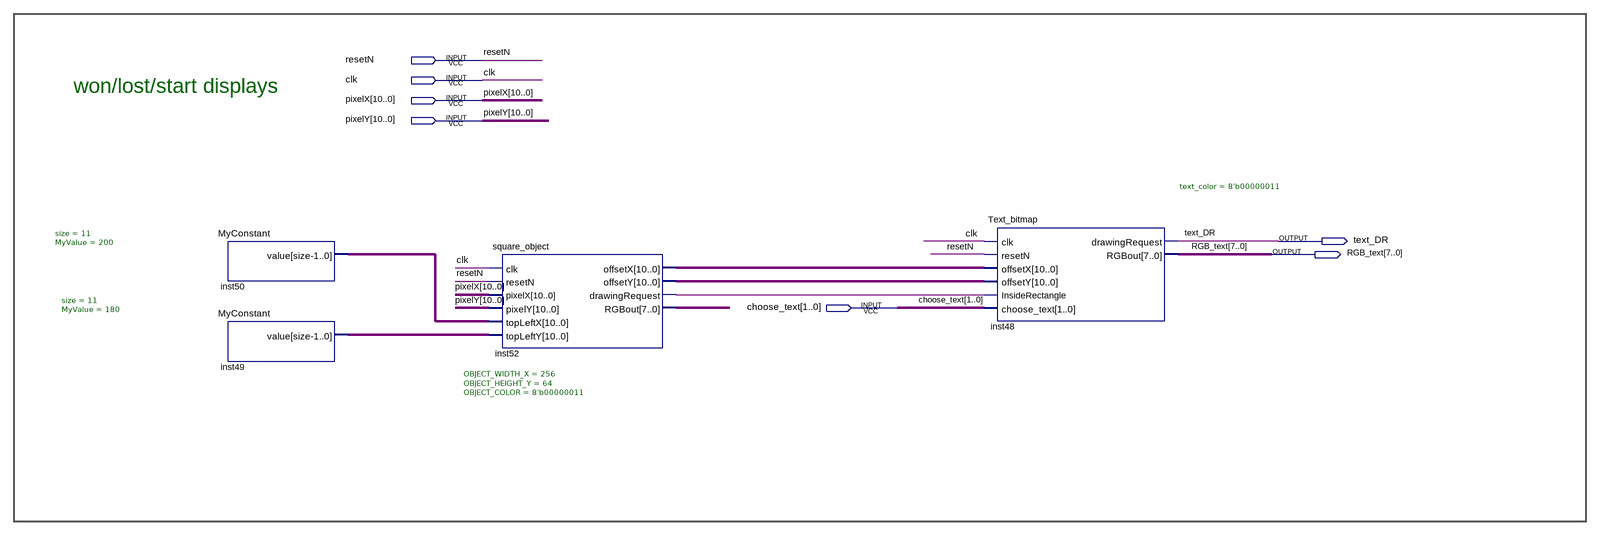
[diagram p0: schematic sheet]
// Quartus schematic win_lose_start_displays.bdf as structural Verilog: 4 symbols, 7 pins
module win_lose_start_displays (
  input  resetN,
  input  clk,
  input  [10:0] pixelX,
  input  [10:0] pixelY,
  input  [1:0] choose_text,
  output text_DR,
  output [7:0] RGB_text
);

  wire inst52_drawingrequest;
  wire [7:0] inst52_rgbout;
  wire [10:0] inst49_value, inst50_value, inst52_offsetx, inst52_offsety;

  MyConstant #(.size(11), .MyValue(200)) inst50 (.value(inst50_value));
  MyConstant #(.size(11), .MyValue(180)) inst49 (.value(inst49_value));
  square_object #(.OBJECT_WIDTH_X(256), .OBJECT_HEIGHT_Y(64), .OBJECT_COLOR(8'b00000011)) inst52 (
    .clk(clk), .resetN(resetN), .pixelX(pixelX), .pixelY(pixelY), .topLeftX(inst50_value),
    .topLeftY(inst49_value), .offsetX(inst52_offsetx), .offsetY(inst52_offsety),
    .drawingRequest(inst52_drawingrequest), .RGBout(inst52_rgbout));
  Text_bitmap #(.text_color(8'b00000011)) inst48 (
    .clk(clk), .resetN(resetN), .offsetX(inst52_offsetx), .offsetY(inst52_offsety),
    .InsideRectangle(inst52_drawingrequest), .choose_text(choose_text), .drawingRequest(text_DR),
    .RGBout(RGB_text));

  // Notes on the sheet:
  //   won/lost/start displays
endmodule
